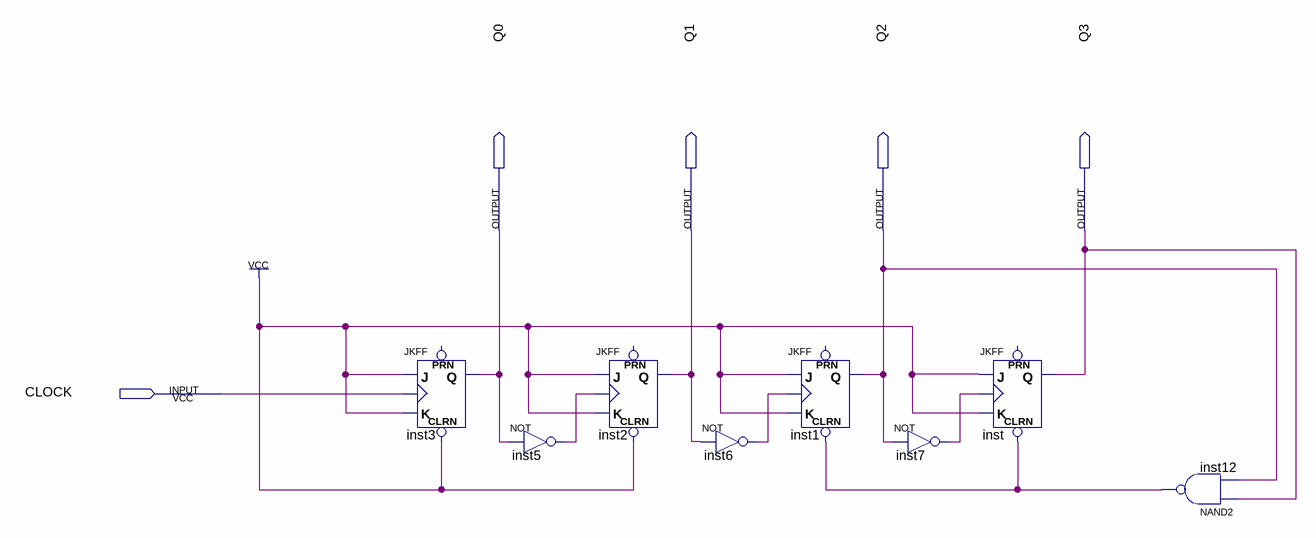
[diagram p0: schematic sheet]
// Quartus schematic LAB4_HocBu.bdf as structural Verilog: 8 symbols, 5 pins
module LAB4_HocBu (
  input  CLOCK,
  output Q0,
  output Q1,
  output Q2,
  output Q3
);

  wire inst5_out, inst6_out, inst7_out, inst12_out;

  JKFF inst3 (.CLRN(1'b1), .K(1'b1), .J(1'b1), .CLK(CLOCK), .Q(Q0));  // open: PRN
  not inst5 (inst5_out, Q0);
  JKFF inst2 (.CLRN(1'b1), .K(1'b1), .J(1'b1), .CLK(inst5_out), .Q(Q1));  // open: PRN
  not inst6 (inst6_out, Q1);
  JKFF inst1 (.CLRN(inst12_out), .K(1'b1), .J(1'b1), .CLK(inst6_out), .Q(Q2));  // open: PRN
  not inst7 (inst7_out, Q2);
  JKFF inst (.CLRN(inst12_out), .K(1'b1), .J(1'b1), .CLK(inst7_out), .Q(Q3));  // open: PRN
  nand inst12 (inst12_out, Q3, Q2);
endmodule
